# EAGLE schematic snc98_Display_15x7-Seg_3-digit_LTD056 (EAGLE 6.6.0)

## Sheet 1 of 2
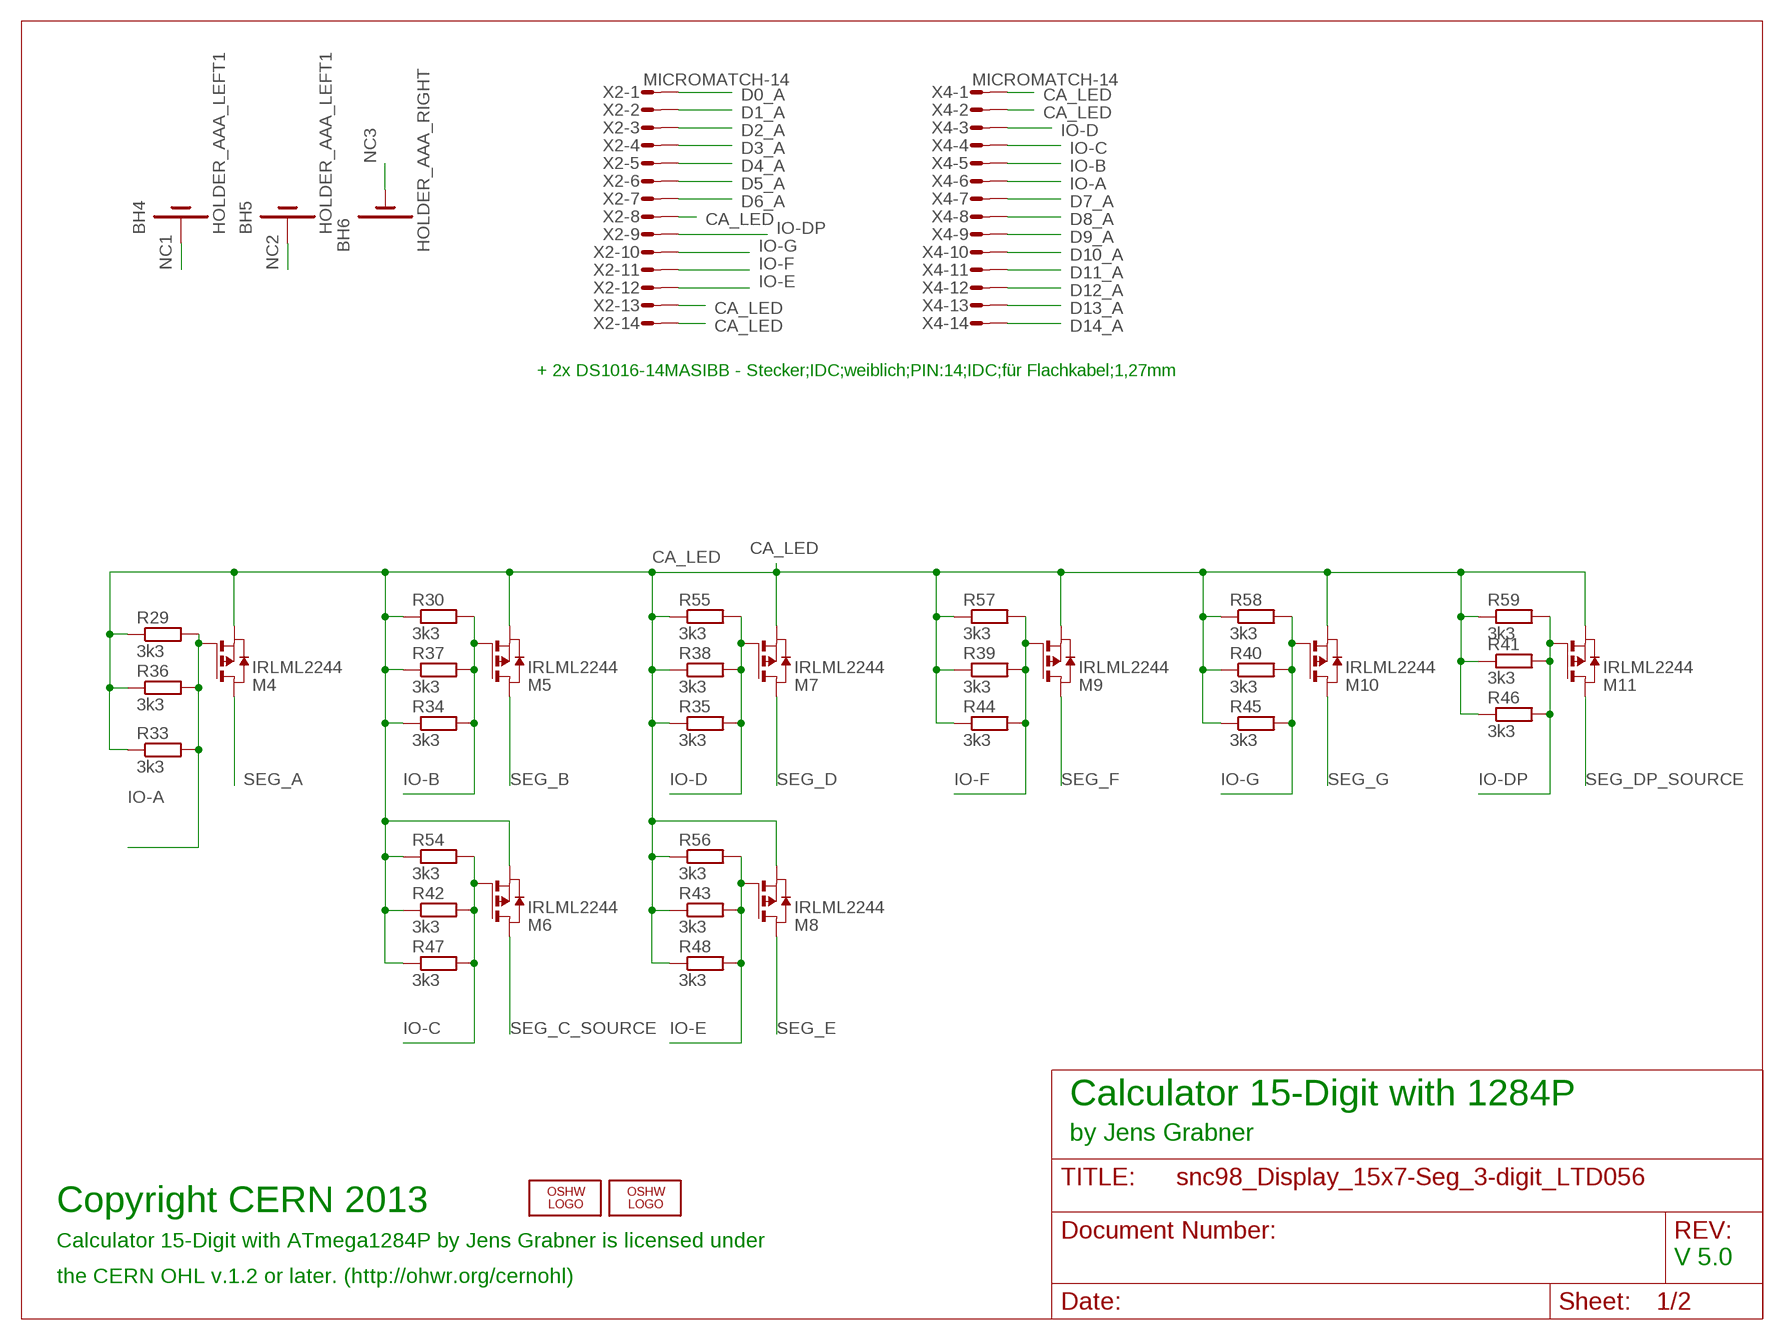
[diagram p0: schematic, sheet 1]

### Parts
BH4  HOLDER_AAA_LEFT1  [BATTERY-AAA-LEFT]
BH5  HOLDER_AAA_LEFT1  [BATTERY-AAA-LEFT]
BH6  HOLDER_AAA_RIGHT  [BATTERY-AAA-RIGHT]
LOGO1  OSHW_LOGO_8MILX0150-NT  [OSHW_8X150_NOTEXT]
LOGO3  OSHW_LOGO_6MILX0100-NT  [OSHW_6X100_NOTEXT]
M4  IRLML2244  IRLML6402  [SOT-23]
M5  IRLML2244  IRLML6402  [SOT-23]
M6  IRLML2244  IRLML6402  [SOT-23]
M7  IRLML2244  IRLML6402  [SOT-23]
M8  IRLML2244  IRLML6402  [SOT-23]
M9  IRLML2244  IRLML6402  [SOT-23]
M10  IRLML2244  IRLML6402  [SOT-23]
M11  IRLML2244  IRLML6402  [SOT-23]
R29  3k3  R-EU_0204/5  [0204/5]
R30  3k3  R-EU_0204/5  [0204/5]
R33  3k3  R-EU_M0805  [M0805]
R34  3k3  R-EU_M0805  [M0805]
R35  3k3  R-EU_M0805  [M0805]
R36  3k3  R-EU_R1206  [R1206]
R37  3k3  R-EU_R1206  [R1206]
R38  3k3  R-EU_R1206  [R1206]
R39  3k3  R-EU_R1206  [R1206]
R40  3k3  R-EU_R1206  [R1206]
R41  3k3  R-EU_R1206  [R1206]
R42  3k3  R-EU_R1206  [R1206]
R43  3k3  R-EU_R1206  [R1206]
R44  3k3  R-EU_M0805  [M0805]
R45  3k3  R-EU_M0805  [M0805]
R46  3k3  R-EU_M0805  [M0805]
R47  3k3  R-EU_M0805  [M0805]
R48  3k3  R-EU_M0805  [M0805]
R54  3k3  R-EU_0204/5  [0204/5]
R55  3k3  R-EU_0204/5  [0204/5]
R56  3k3  R-EU_0204/5  [0204/5]
R57  3k3  R-EU_0204/5  [0204/5]
R58  3k3  R-EU_0204/5  [0204/5]
R59  3k3  R-EU_0204/5  [0204/5]
X2  MICROMATCH-14  [MICROMATCH-14]
X4  MICROMATCH-14  [MICROMATCH-14]

### Nets
CA_LED: M4.2(S) M5.2(S) M6.2(S) M7.2(S) M8.2(S) M9.2(S) M10.2(S) M11.2(S) R29.1 R30.1 R33.1 R34.1 R35.1 R36.1 R37.1 R38.1 R39.1 R40.1 R41.1 R42.1 R43.1 R44.1 R45.1 R46.1 R47.1 R48.1 R54.1 R55.1 R56.1 R57.1 R58.1 R59.1 X2.8 X2.13 X2.14 X4.1 X4.2 ; also sheet 2
D0_A: X2.1 ; also sheet 2
D1_A: X2.2 ; also sheet 2
D2_A: X2.3 ; also sheet 2
D3_A: X2.4 ; also sheet 2
D4_A: X2.5 ; also sheet 2
D5_A: X2.6 ; also sheet 2
D6_A: X2.7 ; also sheet 2
D7_A: X4.7 ; also sheet 2
D8_A: X4.8 ; also sheet 2
D9_A: X4.9 ; also sheet 2
D10_A: X4.10 ; also sheet 2
D11_A: X4.11 ; also sheet 2
D12_A: X4.12 ; also sheet 2
D13_A: X4.13 ; also sheet 2
D14_A: X4.14 ; also sheet 2
IO-A: M4.1(G) R29.2 R33.2 R36.2 X4.6
IO-B: M5.1(G) R30.2 R34.2 R37.2 X4.5
IO-C: M6.1(G) R42.2 R47.2 R54.2 X4.4
IO-D: M7.1(G) R35.2 R38.2 R55.2 X4.3
IO-DP: M11.1(G) R41.2 R46.2 R59.2 X2.9
IO-E: M8.1(G) R43.2 R48.2 R56.2 X2.12
IO-F: M9.1(G) R39.2 R44.2 R57.2 X2.11
IO-G: M10.1(G) R40.2 R45.2 R58.2 X2.10
NC1: BH4.P1(+) BH4.P2(+) BH4.P3(+) BH4.P4(+)
NC2: BH5.P1(+) BH5.P2(+) BH5.P3(+) BH5.P4(+)
NC3: BH6.M1(-) BH6.M2(-) BH6.M3(-) BH6.M4(-)
SEG_A: M4.3(D) ; also sheet 2
SEG_B: M5.3(D) ; also sheet 2
SEG_C_SOURCE: M6.3(D) ; also sheet 2
SEG_D: M7.3(D) ; also sheet 2
SEG_DP_SOURCE: M11.3(D) ; also sheet 2
SEG_E: M8.3(D) ; also sheet 2
SEG_F: M9.3(D) ; also sheet 2
SEG_G: M10.3(D) ; also sheet 2

### Notes on the sheet
- + 2x DS1016-14MASIBB - Stecker;IDC;weiblich;PIN:14;IDC;für Flachkabel;1,27mm
- Calculator 15-Digit with 1284P
- by Jens Grabner
- Copyright CERN 2013
- Calculator 15-Digit with ATmega1284P by Jens Grabner is licensed under
- V 5.0
- the CERN OHL v.1.2 or later. (http://ohwr.org/cernohl)

## Sheet 2 of 2
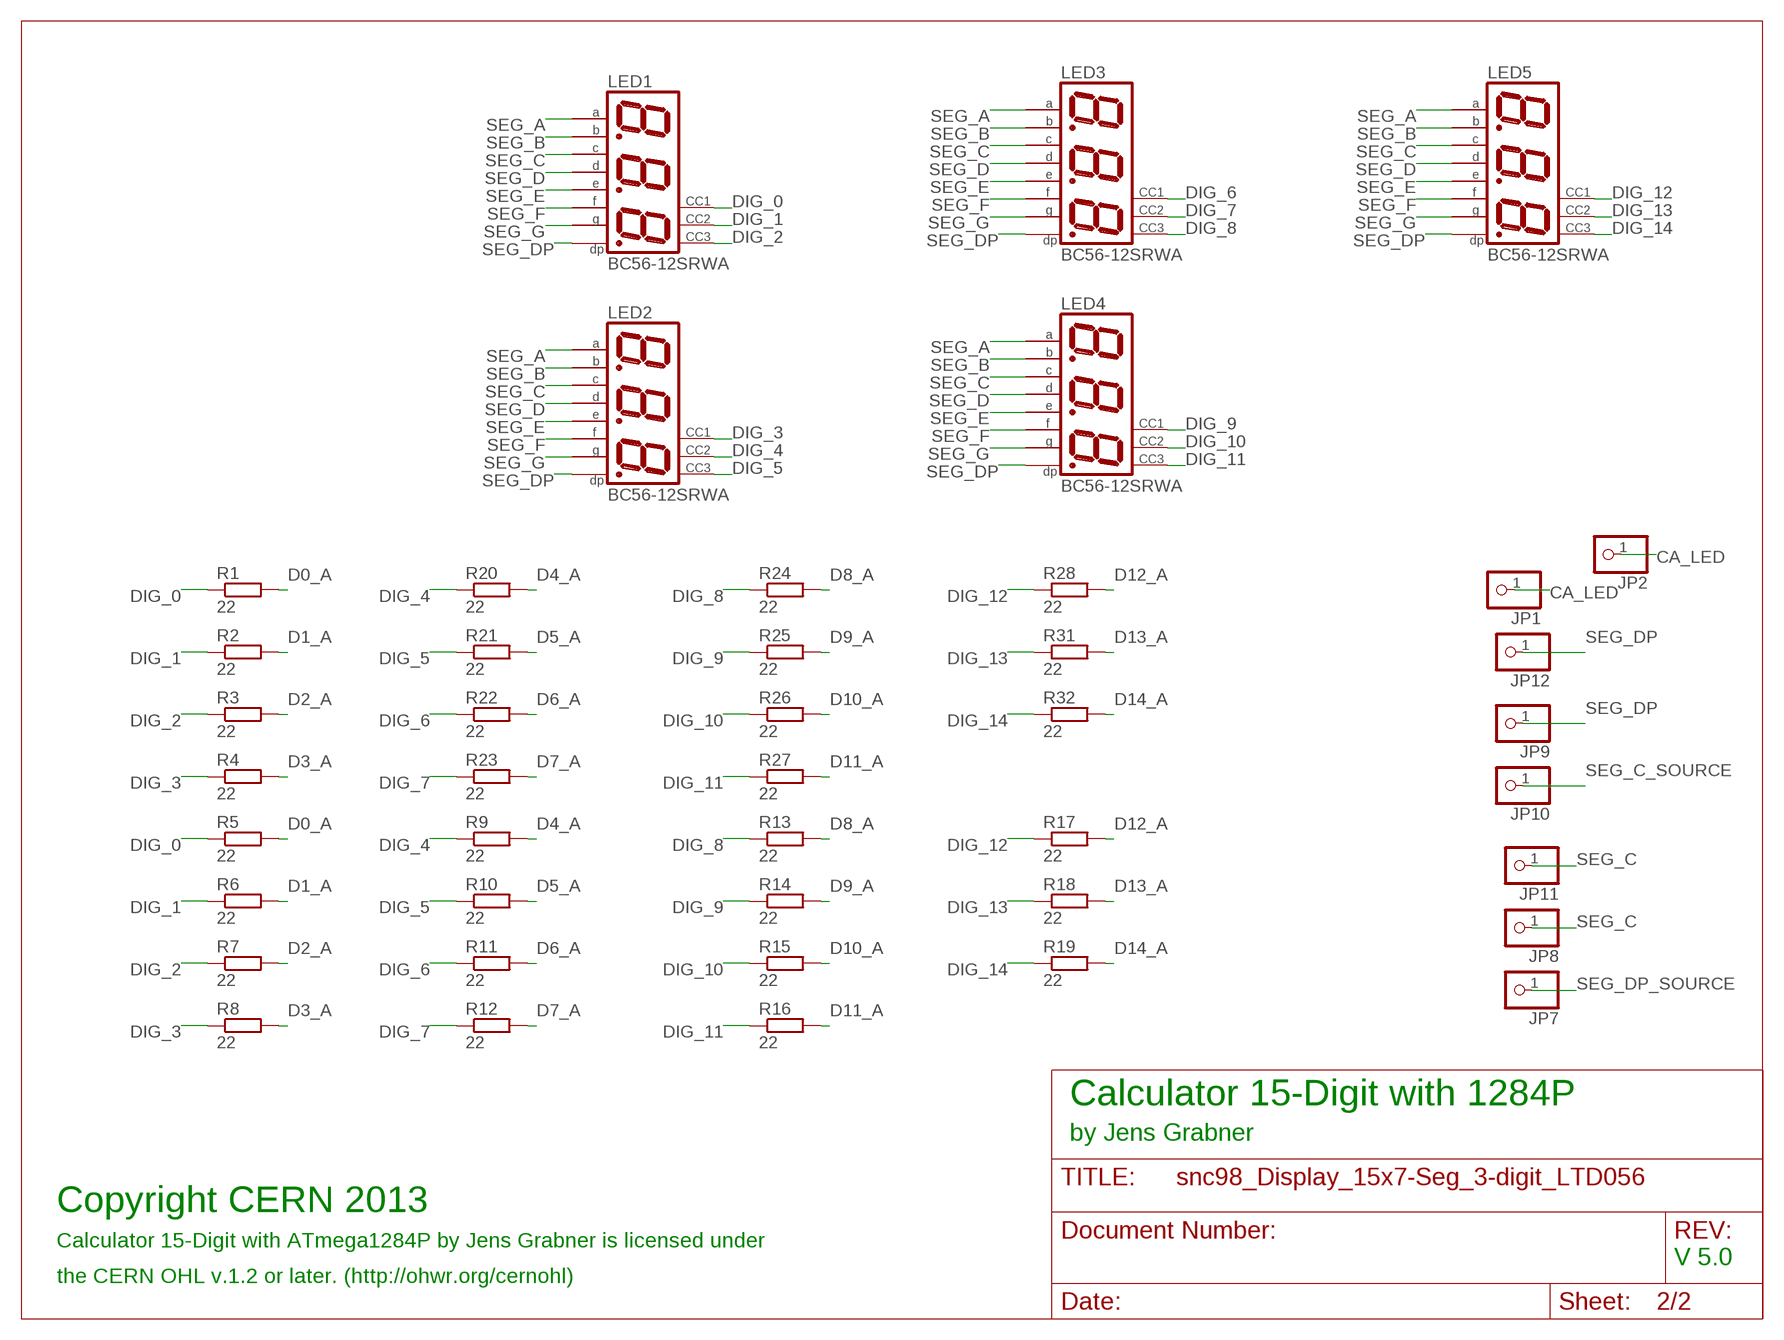
[diagram p1: schematic, sheet 2]

### Parts
JP1  PINHD-1X1  [1X01]
JP2  PINHD-1X1  [1X01]
JP7  PINHD-1X1  [1X01]
JP8  PINHD-1X1  [1X01]
JP9  PINHD-1X1  [1X01]
JP10  PINHD-1X1  [1X01]
JP11  PINHD-1X1  [1X01]
JP12  PINHD-1X1  [1X01]
LED1  BC56-12SRWA  [BX56-12]
LED2  BC56-12SRWA  [BX56-12]
LED3  BC56-12SRWA  [BX56-12]
LED4  BC56-12SRWA  [BX56-12]
LED5  BC56-12SRWA  [BX56-12]
R1  22  R-EU_R0805  [R0805]
R2  22  R-EU_R0805  [R0805]
R3  22  R-EU_R0805  [R0805]
R4  22  R-EU_R0805  [R0805]
R5  22  R-EU_R1210  [R1210]
R6  22  R-EU_R1210  [R1210]
R7  22  R-EU_R1210  [R1210]
R8  22  R-EU_R1210  [R1210]
R9  22  R-EU_R1210  [R1210]
R10  22  R-EU_R1210  [R1210]
R11  22  R-EU_R1210  [R1210]
R12  22  R-EU_R1210  [R1210]
R13  22  R-EU_R1210  [R1210]
R14  22  R-EU_R1210  [R1210]
R15  22  R-EU_R1210  [R1210]
R16  22  R-EU_R1210  [R1210]
R17  22  R-EU_R1210  [R1210]
R18  22  R-EU_R1210  [R1210]
R19  22  R-EU_R1210  [R1210]
R20  22  R-EU_R0805  [R0805]
R21  22  R-EU_R0805  [R0805]
R22  22  R-EU_R0805  [R0805]
R23  22  R-EU_R0805  [R0805]
R24  22  R-EU_R0805  [R0805]
R25  22  R-EU_R0805  [R0805]
R26  22  R-EU_R0805  [R0805]
R27  22  R-EU_R0805  [R0805]
R28  22  R-EU_R0805  [R0805]
R31  22  R-EU_R0805  [R0805]
R32  22  R-EU_R0805  [R0805]

### Nets
CA_LED: JP1.1 JP2.1 ; also sheet 1
D0_A: R1.2 R5.2 ; also sheet 1
D1_A: R2.2 R6.2 ; also sheet 1
D2_A: R3.2 R7.2 ; also sheet 1
D3_A: R4.2 R8.2 ; also sheet 1
D4_A: R9.2 R20.2 ; also sheet 1
D5_A: R10.2 R21.2 ; also sheet 1
D6_A: R11.2 R22.2 ; also sheet 1
D7_A: R12.2 R23.2 ; also sheet 1
D8_A: R13.2 R24.2 ; also sheet 1
D9_A: R14.2 R25.2 ; also sheet 1
D10_A: R15.2 R26.2 ; also sheet 1
D11_A: R16.2 R27.2 ; also sheet 1
D12_A: R17.2 R28.2 ; also sheet 1
D13_A: R18.2 R31.2 ; also sheet 1
D14_A: R19.2 R32.2 ; also sheet 1
DIG_0: LED1.12(CA) R1.1 R5.1
DIG_1: LED1.9(CA) R2.1 R6.1
DIG_2: LED1.8(CA) R3.1 R7.1
DIG_3: LED2.12(CA) R4.1 R8.1
DIG_4: LED2.9(CA) R9.1 R20.1
DIG_5: LED2.8(CA) R10.1 R21.1
DIG_6: LED3.12(CA) R11.1 R22.1
DIG_7: LED3.9(CA) R12.1 R23.1
DIG_8: LED3.8(CA) R13.1 R24.1
DIG_9: LED4.12(CA) R14.1 R25.1
DIG_10: LED4.9(CA) R15.1 R26.1
DIG_11: LED4.8(CA) R16.1 R27.1
DIG_12: LED5.12(CA) R17.1 R28.1
DIG_13: LED5.9(CA) R18.1 R31.1
DIG_14: LED5.8(CA) R19.1 R32.1
SEG_A: LED1.11(A) LED2.11(A) LED3.11(A) LED4.11(A) LED5.11(A) ; also sheet 1
SEG_B: LED1.7(B) LED2.7(B) LED3.7(B) LED4.7(B) LED5.7(B) ; also sheet 1
SEG_C: JP8.1 JP11.1 LED1.4(C) LED2.4(C) LED3.4(C) LED4.4(C) LED5.4(C)
SEG_C_SOURCE: JP10.1 ; also sheet 1
SEG_D: LED1.2(D) LED2.2(D) LED3.2(D) LED4.2(D) LED5.2(D) ; also sheet 1
SEG_DP: JP9.1 JP12.1 LED1.3(DP) LED2.3(DP) LED3.3(DP) LED4.3(DP) LED5.3(DP)
SEG_DP_SOURCE: JP7.1 ; also sheet 1
SEG_E: LED1.1(E) LED2.1(E) LED3.1(E) LED4.1(E) LED5.1(E) ; also sheet 1
SEG_F: LED1.10(F) LED2.10(F) LED3.10(F) LED4.10(F) LED5.10(F) ; also sheet 1
SEG_G: LED1.5(G) LED2.5(G) LED3.5(G) LED4.5(G) LED5.5(G) ; also sheet 1

### Notes on the sheet
- Calculator 15-Digit with 1284P
- by Jens Grabner
- Copyright CERN 2013
- Calculator 15-Digit with ATmega1284P by Jens Grabner is licensed under
- V 5.0
- the CERN OHL v.1.2 or later. (http://ohwr.org/cernohl)

## Library data of the parts
BH4 BH5 = SparkFun-Electromechanical:HOLDER_AAA_LEFT; OC_FARNELL: unknown; TME_EU: BC-0401
BH6 = SparkFun-Electromechanical:HOLDER_AAA_RIGHT; OC_FARNELL: unknown
JP1 JP2 JP7-JP12 = adafruit:PINHD-1X1: Pin header 1x1 for 0.1" spacing With round pins; OC_FARNELL: unknown
LED1-LED5 = display-kingbright-1:B?56-12*WA: 14.22mm (0.56INCH) THREE DIGIT NUMERIC DISPLAY Source: http://www.kingbright.com .. BA56-11EWA(Ver1189474895.pdf; OC_FARNELL: unknown; TME_EU: LTD056AUE-103C
LOGO1 = ohw-logo:OSHW_LOGO_8MIL; OC_FARNELL: unknown
LOGO3 = ohw-logo:OSHW_LOGO_6MIL; OC_FARNELL: unknown
M4-M11 = IRLML6402:IRLML6402; MF: INFINEON; MPN: IRLML2244TRPBF; OC_FARNELL: 2468051; TME_EU: DMG2305UX-7
R1-R32 R36-R43 R54-R59 = rcl:R-EU_: RESISTOR, European symbol; OC_FARNELL: unknown
R33-R35 R44-R48 = rcl:R-EU_: RESISTOR, European symbol; OC_FARNELL: unknown; TME_EU: RC0805FR-073K3
X2 X4 = Con-amp-micromatch:MICROMATCH-14: MicroMaTch 14 8-215464-4 / 1-215464-4 Drawing Number C-215464 DDEController.pdf; MF: AMP - TE CONNECTIVITY; MPN: 8-215464-4; OC_FARNELL: 3784678; OC_NEWARK: 19J6431; TME_EU: DS1015-02-14R6